# EAGLE design shrew (EAGLE 7.6.0)
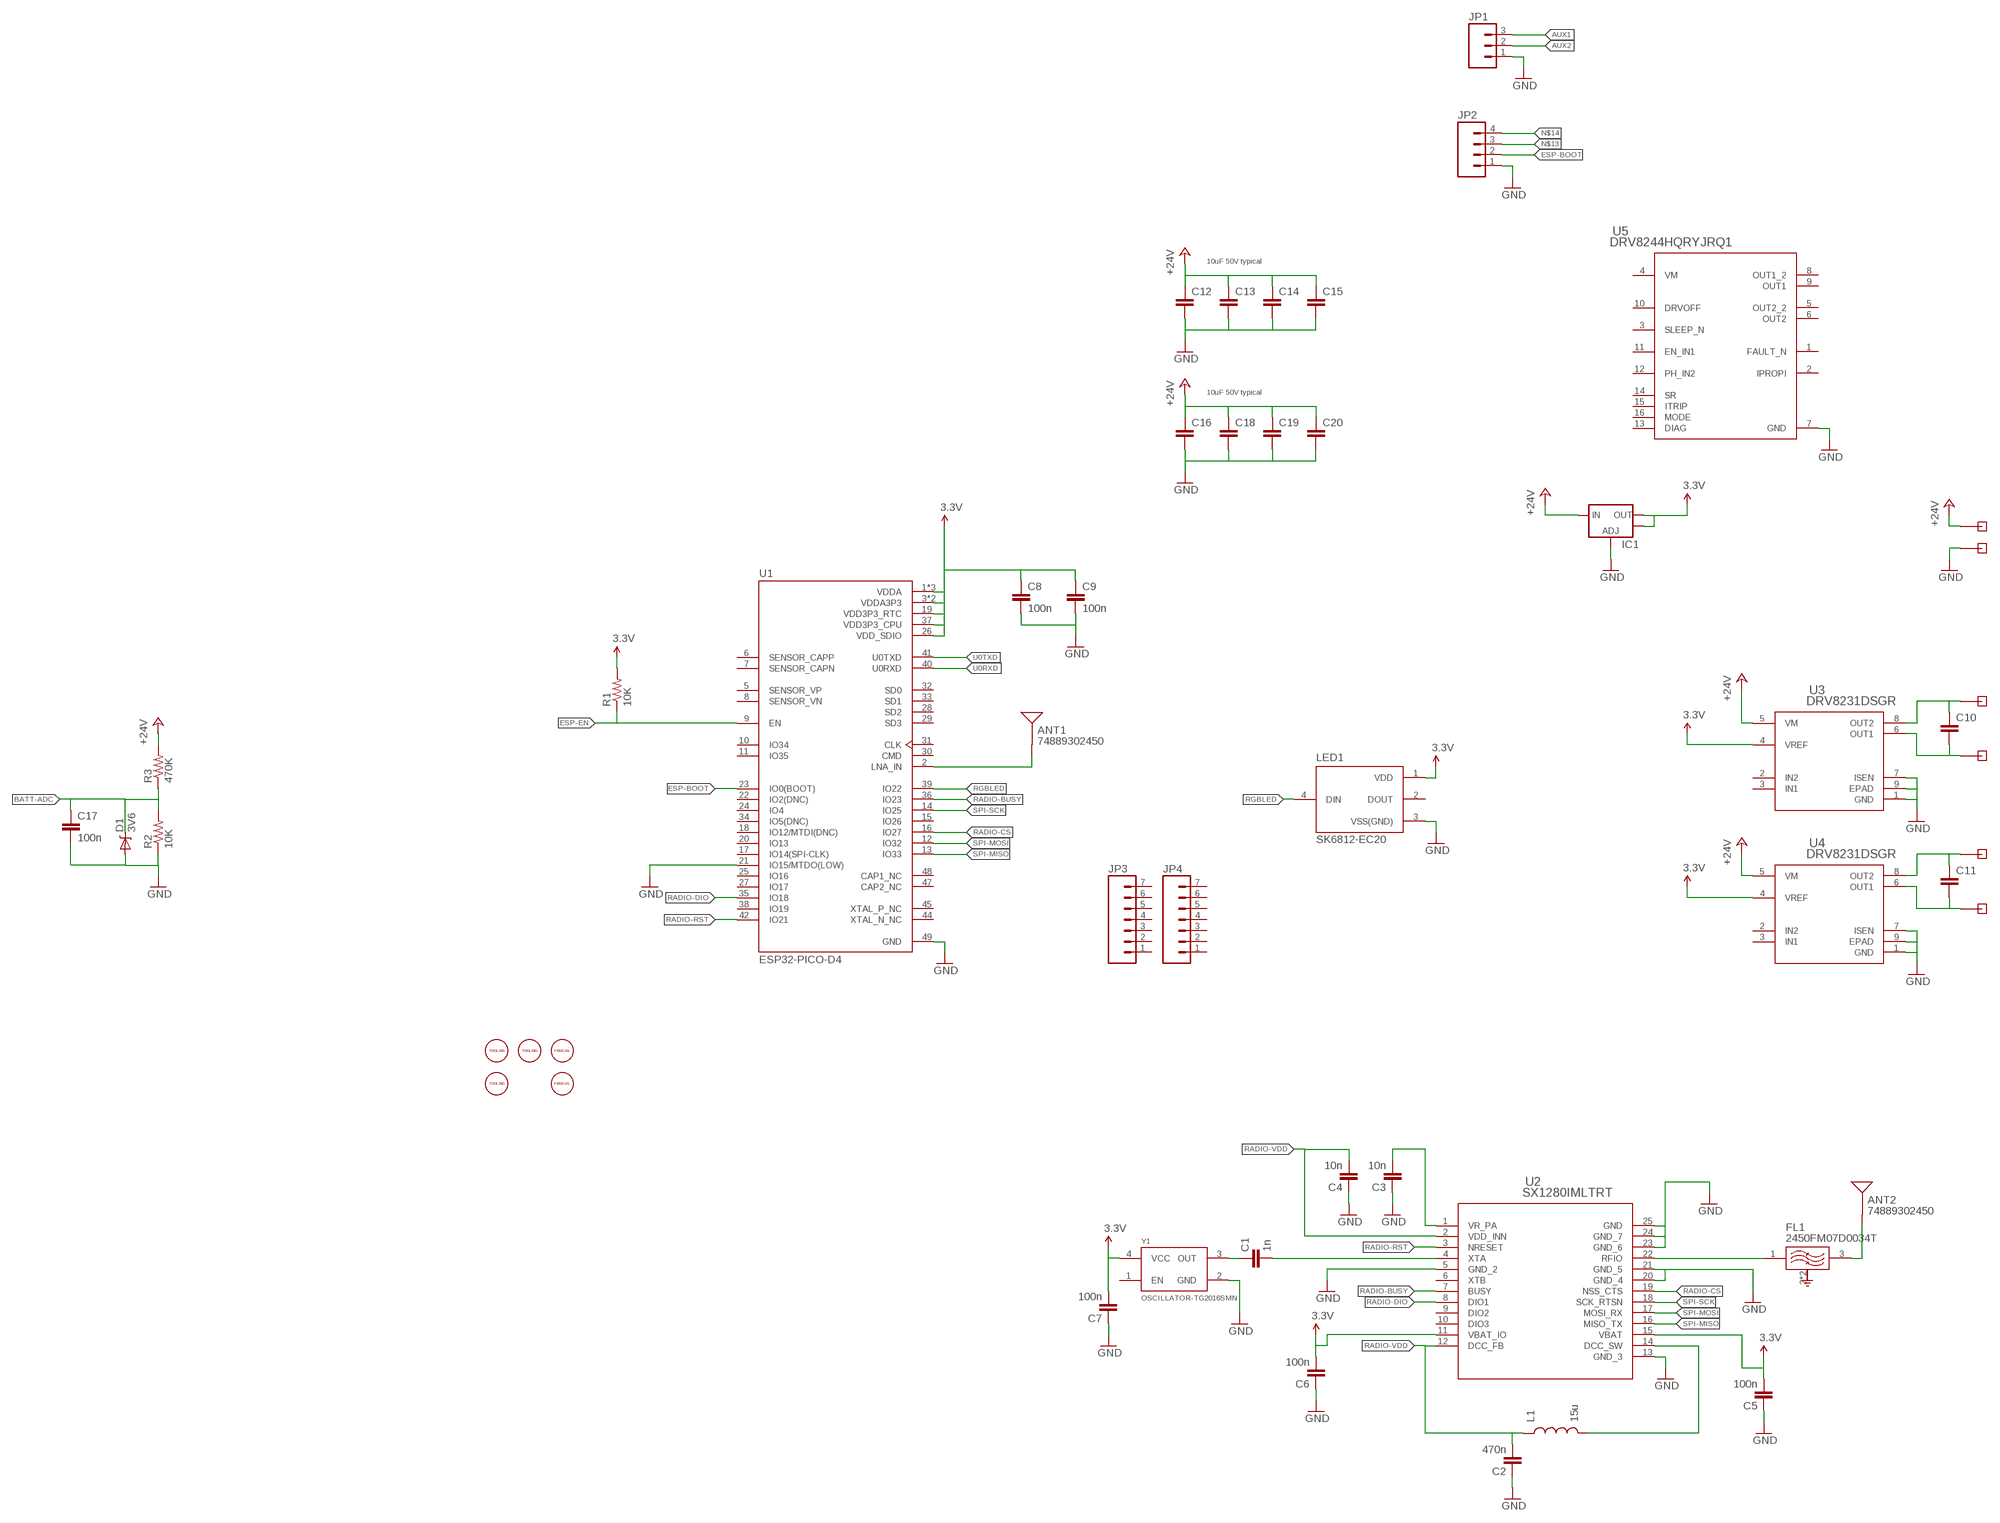
[diagram p0: schematic, sheet 1]

## Parts
ANT1  74889302450  ANTENNA2SMD  [ANTENNA-CHIP2]
ANT2  74889302450  ANTENNA2SMD  [ANTENNA-CHIP2]
C1  1n  CAP0402-CAP  [0402-CAP]
C2  470n  CAP0402-CAP  [0402-CAP]
C3  10n  CAP0402-CAP  [0402-CAP]
C4  10n  CAP0402-CAP  [0402-CAP]
C5  100n  CAP0402-CAP  [0402-CAP]
C6  100n  CAP0402-CAP  [0402-CAP]
C7  100n  CAP0402-CAP  [0402-CAP]
C8  100n  CAP0402-CAP  [0402-CAP]
C9  100n  CAP0402-CAP  [0402-CAP]
C10  CAP0402-CAP  [0402-CAP]
C11  CAP0402-CAP  [0402-CAP]
C12  CAP0805  [0805]
C13  CAP0805  [0805]
C14  CAP0805  [0805]
C15  CAP0805  [0805]
C16  CAP0805  [0805]
C17  100n  CAP0402-CAP  [0402-CAP]
C18  CAP0805  [0805]
C19  CAP0805  [0805]
C20  CAP0805  [0805]
D1  3V6  DIODE-ZENER-BZT52  [SOD-323]
FIDUCIAL1  FIDUCIAL-1MM-2MM  [FIDUCIAL-1MM-2MM]
FIDUCIAL2  FIDUCIAL-1MM-2MM  [FIDUCIAL-1MM-2MM]
FL1  2450FM07D0034T  [FIL_2450FM07D0034T]
IC1  V_REG_LM1117SOT223  [SOT223]
JP1  M03PTH  [1X03]
JP2  M04PTH  [1X04]
JP3  M07-2MM-TH  [1X07-2MM-TH]
JP4  M07-2MM-TH  [1X07-2MM-TH]
L1  15u  INDUCTOR0805  [0805]
LED1  SK6812-EC20  [SK6812-EC20]
R1  10K  RESISTOR0402-RES  [0402-RES]
R2  10K  RESISTOR0402-RES  [0402-RES]
R3  470K  RESISTOR0402-RES  [0402-RES]
TOOLING1  TOOLING-HOLE  [TOOLING-HOLE]
TOOLING2  TOOLING-HOLE  [TOOLING-HOLE]
TOOLING3  TOOLING-HOLE  [TOOLING-HOLE]
U1  ESP32-PICO-D4  [PQFN50P700X700X104-49N]
U2  SX1280IMLTRT  [QFN24_4X4_SEM]
U3  DRV8231DSGR  [WSON8_DRV8231_TEX]
U4  DRV8231DSGR  [WSON8_DRV8231_TEX]
U5  DRV8244HQRYJRQ1  DRV8244SQRYJRQ1  [RYJ0016A-MFG]
X1  PIN-1X-BIG  [PAD-1X-BIG]
X2  PIN-1X-BIG  [PAD-1X-BIG]
X3  PIN-1X-BIG  [PAD-1X-BIG]
X4  PIN-1X-BIG  [PAD-1X-BIG]
X5  PIN-1X-BIG  [PAD-1X-BIG]
X6  PIN-1X-BIG  [PAD-1X-BIG]
Y1  OSCILLATOR-TG2016SMN  [OSC_TG2016SMN_50.0000M-ECGNNMB]

## Nets
3.3V: C5.2 C6.2 C7.2 C8.1 C9.1 IC1.2(OUT) IC1.4(OUT) LED1.1(VDD) R1.2 U1.1(VDDA) U1.3(VDDA3P3) U1.4(VDDA3P3) U1.19(VDD3P3_RTC) U1.26(VDD_SDIO) U1.37(VDD3P3_CPU) U1.43(VDDA) U1.46(VDDA) U2.11(VBAT_IO) U2.15(VBAT) U3.4(VREF) U4.4(VREF) Y1.4(VCC)
+24V: C12.1 C13.1 C14.1 C15.1 C16.1 C18.1 C19.1 C20.1 IC1.3(IN) R3.2 U3.5(VM) U4.5(VM) X5.1
AUX1: JP1.3
AUX2: JP1.2
BATT-ADC: C17.1 D1.1(C) R2.2 R3.1
ESP-BOOT: JP2.2 U1.23(IO0(BOOT))
ESP-EN: R1.1 U1.9(EN)
GND: C2.1 C3.1 C4.1 C5.1 C6.1 C7.1 C8.2 C9.2 C12.2 C13.2 C14.2 C15.2 C16.2 C17.2 C18.2 C19.2 C20.2 D1.2(A) IC1.1(ADJ) JP1.1 JP2.1 LED1.3(VSS(GND)) R2.1 U1.21(IO15/MTDO(LOW)) U1.49(GND) U2.5(GND_2) U2.13(GND_3) U2.20(GND_4) U2.21(GND_5) U2.23(GND_6) U2.24(GND_7) U2.25(GND) U3.1(GND) U3.7(ISEN) U3.9(EPAD) U4.1(GND) U4.7(ISEN) U4.9(EPAD) U5.7(GND) X6.1 Y1.2(GND)
N$1: ANT1.FEED(SIGNAL) U1.2(LNA_IN)
N$2: C1.1 Y1.3(OUT)
N$3: C1.2 U2.4(XTA)
N$4: C10.2 U3.6(OUT1) X1.1
N$5: C10.1 U3.8(OUT2) X2.1
N$6: FL1.1(IN) U2.22(RFIO)
N$7: ANT2.FEED(SIGNAL) FL1.3(OUT)
N$8: C11.2 U4.6(OUT1) X3.1
N$9: L1.2 U2.14(DCC_SW)
N$10: C11.1 U4.8(OUT2) X4.1
N$11: C3.2 U2.1(VR_PA)
N$13: JP2.3
N$14: JP2.4
RADIO-BUSY: U1.36(IO23) U2.7(BUSY)
RADIO-CS: U1.16(IO27) U2.19(NSS_CTS)
RADIO-DIO: U1.35(IO18) U2.8(DIO1)
RADIO-RST: U1.42(IO21) U2.3(NRESET)
RADIO-VDD: C2.2 C4.2 L1.1 U2.2(VDD_INN) U2.12(DCC_FB)
RGBLED: LED1.4(DIN) U1.39(IO22)
SPI-MISO: U1.13(IO33) U2.16(MISO_TX)
SPI-MOSI: U1.12(IO32) U2.17(MOSI_RX)
SPI-SCK: U1.14(IO25) U2.18(SCK_RTSN)
U0RXD: U1.40(U0RXD)
U0TXD: U1.41(U0TXD)
Unconnected: JP3.1 JP3.2 JP3.3 JP3.4 JP3.5 JP3.6 JP3.7 JP4.1 JP4.2 JP4.3 JP4.4 JP4.5 JP4.6 JP4.7 LED1.2(DOUT) U1.5(SENSOR_VP) U1.6(SENSOR_CAPP) U1.7(SENSOR_CAPN) U1.8(SENSOR_VN) U1.10(IO34) U1.11(IO35) U1.15(IO26) U1.17(IO14(SPI-CLK)) U1.18(IO12/MTDI(DNC)) U1.20(IO13) U1.22(IO2(DNC)) U1.24(IO4) U1.25(IO16) U1.27(IO17) U1.28(SD2) U1.29(SD3) U1.30(CMD) U1.31(CLK) U1.32(SD0) U1.33(SD1) U1.34(IO5(DNC)) U1.38(IO19) U1.44(XTAL_N_NC) U1.45(XTAL_P_NC) U1.47(CAP2_NC) U1.48(CAP1_NC) U2.6(XTB) U2.9(DIO2) U2.10(DIO3) U3.2(IN2) U3.3(IN1) U4.2(IN2) U4.3(IN1) U5.1(FAULT_N) U5.2(IPROPI) U5.3(SLEEP_N) U5.4(VM) U5.5(OUT2_2) U5.6(OUT2) U5.8(OUT1_2) U5.9(OUT1) U5.10(DRVOFF) U5.11(EN_IN1) U5.12(PH_IN2) U5.13(DIAG) U5.14(SR) U5.15(ITRIP) U5.16(MODE) Y1.1(EN)

## Notes on the sheet
- 10uF 50V typical
- 10uF 50V typical

## Power pins joined to a net without a drawn wire
GND: FL1.2(GND) FL1.4(GND)

## Library data of the parts
ANT1 ANT2 = shrew-common:ANTENNA2: Antenna Single endded antenna. Common with smaller chip antennas. CHIP4 package is the GPS Chip Antenna SKU: GPS-08418. CHIP5 package is 2.4GHz chip antenna SKU: WRL-00144.
C1-C20 = shrew-common:CAP: Capacitor Standard 0603 ceramic capacitor, and 0.1" leaded capacitor.
D1 = shrew-common:DIODE-ZENER: Zener Diode Production Part - 8199 3.4V Zener Voltage
FIDUCIAL1 FIDUCIAL2 = shrew-core:FIDUCIAL
FL1 = shrew-core:2450FM07D0034T: 2.4GHz ~ 2.5GHz Frequency RF Filter (Radio Frequency) 100MHz Bandwidth 0.75dB 0402 (1005 Metric), 4 PC Pad Check availability <https://pricing.snapeda.com/parts/2450FM07D0034T/Johanson%20Technology%20Inc./view-part?ref=eda>; AVAILABILITY: In Stock; CHECK_PRICES: https://www.snapeda.com/parts/2450FM07D0034T/Johanson+Technology+Inc./view-part/?ref=eda; DESCRIPTION: 2.4GHz ~ 2.5GHz Frequency - RF Filter (Radio Frequency) 100MHz Bandwidth 0.75dB 0402 (1005 Metric), 4 PC Pad; MF: Johanson Technology Inc.; MP: 2450FM07D0034T; PACKAGE: 0402 Johanson Technology Inc.; PRICE: None; SNAPEDA_LINK: https://www.snapeda.com/parts/2450FM07D0034T/Johanson+Technology+Inc./view-part/?ref=snap
IC1 = shrew-common:V_REG_LM1117: Voltage Regulator LM1117 Standard adjustable voltage regulator but in SMD form. Spark Fun Electronics SKU : COM-00595
JP1 = shrew-common:M03: Header 3 Standard 3-pin 0.1" header. Use with straight break away headers (SKU : PRT-00116), right angle break away headers (PRT-00553), swiss pins (PRT-00743), machine pins (PRT-00117), and female headers (PRT-00115). Molex polarized connector foot print use with SKU : PRT-08232 with associated crimp pins and housings.
JP2 = shrew-common:M04: Header 4 Standard 4-pin 0.1" header. Use with straight break away headers (SKU : PRT-00116), right angle break away headers (PRT-00553), swiss pins (PRT-00743), machine pins (PRT-00117), and female headers (PRT-00115). Molex polarized connector foot print use with SKU : PRT-08231 with associated crimp pins and housings. 1MM SMD Version SKU: PRT-10208
JP3 JP4 = shrew-common:M07: Header 7 Standard 7-pin 0.1" header. Use with straight break away headers (SKU : PRT-00116), right angle break away headers (PRT-00553), swiss pins (PRT-00743), machine pins (PRT-00117), and female headers (PRT-00115). NOTES ON THE VARIANTS LOCK and LOCK_LONGPADS... This footprint was designed to help hold the alignment of a through-hole component (i.e. 7-pin header) while soldering it into place. You may notice that each hole has been shifted either up or down by 0.005 of an inch from it's more standard position (which is usually a perfectly straight line). This slight alteration caused the pins (the squares in the middle) to touch the edges of the holes. Because they are alternating, it causes a "brace" to hold the header in place. 0.005 has proven to be the perfect amount of "off-center" position when using our standard breakaway headers. Although looks a little odd when you look at the bare footprint, once you have a header in there, the alteration is very hard to notice. Also, if you push a header all the way into place, it is covered up entirely on the bottom side. This idea of altering the position of holes to aid alignment will be further integrated into the Sparkfun Library for other footprints. It can help hold any component with 3 or more connection pins.
L1 = shrew-common:INDUCTOR: Inductors Basic Inductor/Choke - 0603 and 1206. Footprints are not proven and vary greatly between part numbers.
LED1 = shrew-core:SK6812: SMD 5050 Full color RGB LED data transmission frequency up to 800Kbps, with 30 fps refresh rate, 5.00x5.00 mm Check availability <https://pricing.snapeda.com/parts/SK6812/Shenzhen%20LED%20Color%20Optoelectronic%20Inc./view-part?ref=eda>
R1-R3 = shrew-common:RESISTOR: Resistor Basic schematic elements and footprints for 0603, 1206, and PTH resistors.
TOOLING1-TOOLING3 = shrew-core:TOOLING-HOLE
U1 = shrew-core:ESP32-PICO-D4: Bluetooth, WiFi 802.11b/g/n, Bluetooth v4.2 +EDR, Class 1, 2 and 3 Transceiver Module 2.4GHz ~ 2.5GHz Surface Mount Check availability <https://pricing.snapeda.com/parts/ESP32-PICO-D4/Espressif%20Systems/view-part?ref=eda>; AVAILABILITY: In Stock; CHECK_PRICES: https://www.snapeda.com/parts/ESP32-PICO-D4/Espressif+Systems/view-part/?ref=eda; DESCRIPTION: Bluetooth, WiFi 802.11b/g/n, Bluetooth v4.2 +EDR, Class 1, 2 and 3 Transceiver Module 2.4GHz ~ 2.5GHz - Surface Mount; MF: Espressif Systems; MP: ESP32-PICO-D4; PACKAGE: SMD-48 Espressif Systems; PRICE: None; SNAPEDA_LINK: https://www.snapeda.com/parts/ESP32-PICO-D4/Espressif+Systems/view-part/?ref=snap
U2 = shrew-core:SX1280IMLTRT; COPYRIGHT: Copyright (C) 2024 Ultra Librarian. All rights reserved.; MANUFACTURER_PART_NUMBER: SX1280IMLTRT; MFR_NAME: Semtech
U3 U4 = shrew-core:DRV8231DSGR; COPYRIGHT: Copyright (C) 2024 Ultra Librarian. All rights reserved.; MANUFACTURER_PART_NUMBER: DRV8231DSGR; MFR_NAME: Texas Instruments
U5 = shrew-core:DRV8244SQRYJRQ1; COPYRIGHT: Copyright (C) 2024 Ultra Librarian. All rights reserved.; MANUFACTURER_PART_NUMBER: DRV8244SQRYJRQ1; MFR_NAME: Texas Instruments; REFDES: RefDes; TYPE: TYPE
X1-X6 = shrew-core:PIN-1X
Y1 = shrew-common:OSCILLATOR

## Board
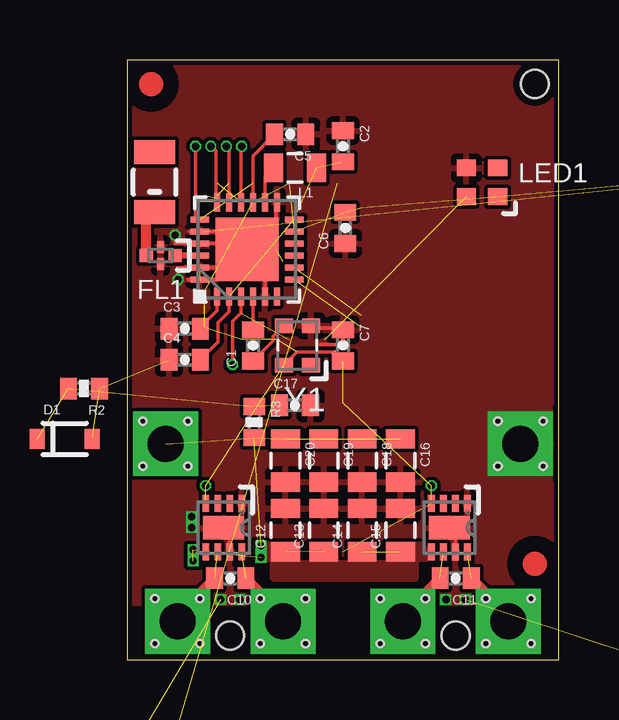
[diagram p1: board, top side]
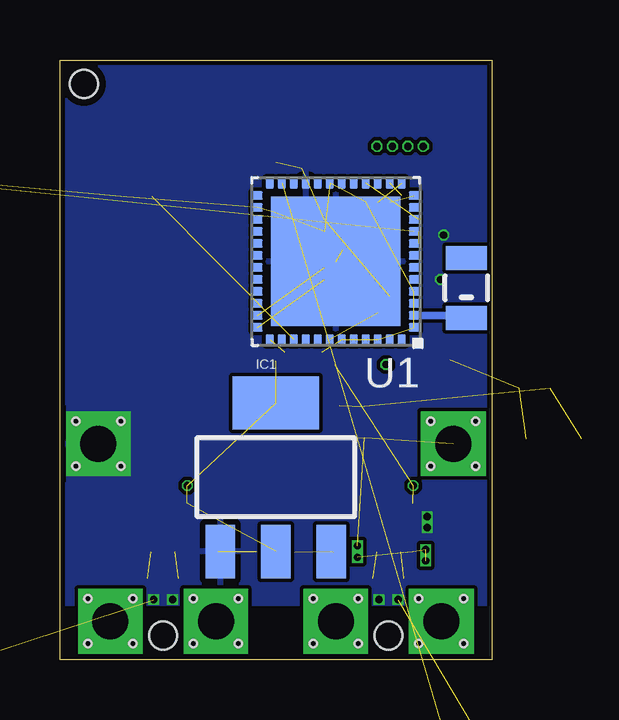
[diagram p2: board, bottom side, seen from below]

Size 18 x 25 mm. Coordinates in mm from the lower left corner, seen from the top.
Outline: 0,0 18,0 18,25 0,25 0,0
Copper layers (1*16): Top 0.035mm / dielectric 1.6mm / Bottom 0.035mm
Design rules "jlcpcb-2layers *": minimum track width 5mil, minimum drill 0.3mm, track to track 5mil, track to pad 5mil, pad to pad 5mil, via to via 5mil, smd to smd 5mil, copper to edge 0.2mm, drill to drill 6mil, minimum pad ring 10mil, minimum via ring 3mil, stop-mask expansion 4mil, vias tented up to drill 20mil, thermal gap 10mil

### Footprints (pad centres in the part's own frame; a part is rotated, then mirrored left to right if it is on the bottom)
ANTENNA-CHIP2 = smd 1.7 x 1: ? 0,-1.25; FEED 0,1.25
0402-CAP = smd 0.7 x 0.9: 1 -0.65,0; 2 0.65,0
0805 = smd 0.8 x 1.2: 1 -0.9,0; 2 0.9,0
SOD-323 = smd 0.63 x 0.83: 1 -1.15,0; 2 1.15,0
FIL_2450FM07D0034T = smd 0.55 x 0.55: 1 -0.6,0; 3 0.6,0 | smd 0.3 x 0.5: 2 0,-0.35; 4 0,0.35
SOT223 = smd 1.219 x 2.235: 1 -2.311,-3.099; 2 0,-3.099; 3 2.311,-3.099 | smd 3.6 x 2.2: 4 0,3.099
1X03 = drill 1.016 pad 1.88 square: 1 0,0 | drill 1.016 pad 1.88: 2 2.54,0; 3 5.08,0
1X04 = drill 1.016 pad 1.88 square: 1 0,0 | drill 1.016 pad 1.88: 2 2.54,0; 3 5.08,0; 4 7.62,0
1X07-2MM-TH = drill 0.8 pad 1.6 octagon: 1 -6,0; 2 -4,0; 3 -2,0; 4 0,0; 5 2,0; 6 4,0; 7 6,0
SK6812-EC20 = smd 0.8 x 0.7: 1 0.65,-0.6; 2 0.65,0.6; 3 -0.65,0.6; 4 -0.65,-0.6
0402-RES = smd 0.7 x 0.9: 1 -0.65,0; 2 0.65,0
TOOLING-HOLE = hole 1.152: 0,0
PQFN50P700X700X104-49N = smd 0.45 x 0.35: 1 -3.265,2.75; 2 -3.265,2.25; 3 -3.265,1.75; 4 -3.265,1.25; 5 -3.265,0.75; 6 -3.265,0.25; 7 -3.265,-0.25; 8 -3.265,-0.75; 9 -3.265,-1.25; 10 -3.265,-1.75; 11 -3.265,-2.25; 12 -3.265,-2.75; 25 3.265,-2.75; 26 3.265,-2.25; 27 3.265,-1.75; 28 3.265,-1.25; 29 3.265,-0.75; 30 3.265,-0.25; 31 3.265,0.25; 32 3.265,0.75; 33 3.265,1.25; 34 3.265,1.75; 35 3.265,2.25; 36 3.265,2.75 | smd 0.35 x 0.45: 13 -2.75,-3.265; 14 -2.25,-3.265; 15 -1.75,-3.265; 16 -1.25,-3.265; 17 -0.75,-3.265; 18 -0.25,-3.265; 19 0.25,-3.265; 20 0.75,-3.265; 21 1.25,-3.265; 22 1.75,-3.265; 23 2.25,-3.265; 24 2.75,-3.265; 37 2.75,3.265; 38 2.25,3.265; 39 1.75,3.265; 40 1.25,3.265; 41 0.75,3.265; 42 0.25,3.265; 43 -0.25,3.265; 44 -0.75,3.265; 45 -1.25,3.265; 46 -1.75,3.265; 47 -2.25,3.265; 48 -2.75,3.265 | smd 5.4 x 5.4: 49 0,0
QFN24_4X4_SEM = smd 0.762 x 0.254: 1 -1.968,1.25; 2 -1.968,0.75; 3 -1.968,0.25; 4 -1.968,-0.25; 5 -1.968,-0.75; 6 -1.968,-1.25; 13 1.968,-1.25; 14 1.968,-0.75; 15 1.968,-0.25; 16 1.968,0.25; 17 1.968,0.75; 18 1.968,1.25 | smd 0.254 x 0.762: 7 -1.25,-1.968; 8 -0.75,-1.968; 9 -0.25,-1.968; 10 0.25,-1.968; 11 0.75,-1.968; 12 1.25,-1.968; 19 1.25,1.968; 20 0.75,1.968; 21 0.25,1.968; 22 -0.25,1.968; 23 -0.75,1.968; 24 -1.25,1.968 | smd 2.642 x 2.642: 25 0,0
WSON8_DRV8231_TEX = smd 0.711 x 0.279: 1 -1.003,0.75; 2 -1.003,0.25; 3 -1.003,-0.25; 4 -1.003,-0.75; 5 1.003,-0.75; 6 1.003,-0.25; 7 1.003,0.25; 8 1.003,0.75 | smd 0.991 x 1.702: 9 0,0
RYJ0016A-MFG = smd 0.6 x 0.25: 1 -1.4,2.375; 2 -1.4,1.875; 3 -1.4,1.375; 10 1.4,1.375; 11 1.4,1.875; 12 1.4,2.375 | smd 3.5 x 0.5: 4 0,0.7 | smd 1.675 x 0.5: 5 -0.913,-0.2; 6 -0.913,-1; 8 0.913,-1; 9 0.913,-0.2 | smd 3.5 x 1.6: 7 0,-2.45 | smd 0.25 x 0.6: 13 0.75,2.9; 14 0.25,2.9; 15 -0.25,2.9; 16 -0.75,2.9
PAD-1X-BIG = drill 1.5 pad 2.5 square: 1 0,0 | hole 0.3: -0.94,0.94; 0.94,0.94; -0.94,-0.94; 0.94,-0.94
OSC_TG2016SMN_50.0000M-ECGNNMB = smd 0.75 x 0.6: 1 -0.565,0.825; 2 -0.565,-0.825; 3 0.565,-0.825; 4 0.565,0.825

### Placement (x,y rotation side)
ANT1  1.05,15.5 180 bottom
ANT2  1.15,19.9 180 top
C1  5.25,13.1 90 top
C2  9,21.4 270 top
C3  2.4,13.8 0 top
C4  2.4,12.5 0 top
C5  6.8,21.9 180 top
C6  9.1,18 90 top
C7  9,13.1 270 top
C8  42.1,-6.9 0 top  (outside the outline)
C9  42.1,-9.8 0 top  (outside the outline)
C10  4.3,3.39 180 top
C11  13.7,3.39 180 top
C12  6.6,5.4 90 top
C13  8.2,5.4 90 top
C14  9.8,5.4 90 top
C15  11.4,5.4 90 top
C16  11.4,8.3 270 top
C17  7,10.6 0 top
C18  9.8,8.3 270 top
C19  8.2,8.3 270 top
C20  6.6,8.3 270 top
D1  -2.6,9.2 0 top
FIDUCIAL1  17,4 0 top
FIDUCIAL2  1,24 0 top
FL1  1.4,16.85 180 top
IC1  9,7.6 0 bottom
JP1  -14.4,-45.3 0 top  (outside the outline)
JP2  -14.4,-50.2 0 top  (outside the outline)
JP3  -14.4,-55.1 0 top  (outside the outline)
JP4  -14.4,-60 0 top  (outside the outline)
L1  7,20.5 180 top
LED1  14.8,19.9 0 top
R1  46.2,22.2 0 top  (outside the outline)
R2  -1.8,11.3 180 top
R3  5.3,9.9 270 top
TOOLING1  4.3,1 0 top
TOOLING2  13.7,1 0 top
TOOLING3  17,24 0 top
U1  6.5,16.6 180 bottom
U2  5,17.1 90 top
U3  4.03,5.5 270 top
U4  13.44,5.5 270 top
U5  -9.2,-17.1 0 top  (outside the outline)
X1  2.1,1.6 0 top
X2  6.5,1.6 0 top
X3  11.5,1.6 0 top
X4  15.9,1.6 0 top
X5  1.6,9 0 top
X6  16.4,9 0 top
Y1  7.1,13.1 180 top

### Tracks (layer width: path | path; a pad name or v marks a point on that pad's centre or on a via)
3.3V  (via drill 0.3)  (21 unrouted)
  Top 0.152: C7.2 8.63,12.82 7.08,12.82 Y1.4 | U2.15 5.25,21 C5.2
  other vias: 3.27,7.25 12.69,7.25
+24V  (via drill 0.3)  (12 unrouted)
  other vias: 2.75,4.58 2.75,4.12 5.59,4.74 5.59,4.26
  pour Top (isolate 0.305, no thermals): 5.58,4.77 6.23,4.77 7,4 11.11,4 11.88,4.77 12.75,4.77 12.75,4.22 12,4.22 12,3.4 6.1,3.4 6.1,4.22 5.58,4.22
BATT-ADC  (3 unrouted)
ESP-BOOT  (1 unrouted)
ESP-EN  (1 unrouted)
GND  (via drill 0.3)  (10 unrouted)
  Top 0.152: v2,17.7 2,17.35 5,17.35 U2.25 | v2.13,15.85 2.13,16.35 5,16.35 U2.25 | 8.07,13.13 9,13.13 9,13.49 | 7.72,13.83 8.95,13.83 | U2.5 5.75,17.1 U2.25 | 6.2,18.94 6.2,17.1 U2.25 | 2.61,17.85 5,17.85 U2.25 | 2.55,15.85 5,15.85 U2.25 | U3.7 4.28,5.5 U3.9 | U4.7 13.69,5.5 U4.9
  other vias: 2.69,5.5 2.69,5.96 3.9,2.5 4.7,2.5 13.3,2.5 14.1,2.5
  pour Top (isolate 0.152, rank 5): 0,2.3 0,25 18,25 18,2.3
  pour Bottom (isolate 0.152, rank 5): 0,2.3 0,25 18,25 18,2.3
  pour Bottom (isolate 0.254, no thermals): 14.8,10.7 14.8,7.4 17.8,7.4 17.8,10.7
  pour Top (isolate 0.254, no thermals): 14.8,10.7 14.8,7.4 17.8,7.4 17.8,10.7
N$1
  Bottom 0.305: U1.2 1.05,14.35 ANT1.FEED
N$2
  Top 0.152: Y1.3 6.08,13.47 6.08,13.28 C1.1
N$3
  Top 0.152: C1.2 U2.4
N$4  (1 unrouted)
  Top 0.406: C10.2 2.1,1.84 X1.1
N$5  (1 unrouted)
  Top 0.406: C10.1 6.5,1.84 X2.1
N$6
  Top 0.25: U2.22 FL1.1
N$7
  Top 0.406: FL1.3 0.8,18.65 ANT2.FEED
N$8  (1 unrouted)
  Top 0.406: C11.2 11.5,1.84 X3.1
N$9
  Top 0.152: U2.14 5.75,20.1 L1.2
N$10  (1 unrouted)
  Top 0.406: C11.1 15.9,1.84 X4.1
N$11
  Top 0.152: U2.1 3.75,14.55 3.05,13.85 C3.2
RADIO-BUSY  (1 unrouted)
RADIO-CS  (via drill 0.3)  (1 unrouted)
  Top 0.152: v2.85,21.4 2.85,18.35 U2.19
RADIO-DIO  (1 unrouted)
RADIO-RST  (via drill 0.3)  (1 unrouted)
  Top 0.152: U2.3 4.75,14.45 4.4,14.1 v4.4,12.3
RADIO-VDD  (3 unrouted)
  Top 0.152: U2.2 4.25,14.51 3.8,14.06 3.8,13.25 C4.2
RGBLED  (1 unrouted)
SPI-MISO  (via drill 0.3)  (1 unrouted)
  Top 0.152: U2.16 4.75,21.37 v4.78,21.4
SPI-MOSI  (via drill 0.3)  (1 unrouted)
  Top 0.152: U2.17 4.25,21.29 v4.14,21.4
SPI-SCK  (via drill 0.3)  (1 unrouted)
  Top 0.152: U2.18 3.75,19.35 3.7,19.4 3.7,21.19 v3.49,21.4